# EAGLE design working (EAGLE 9.6.2)
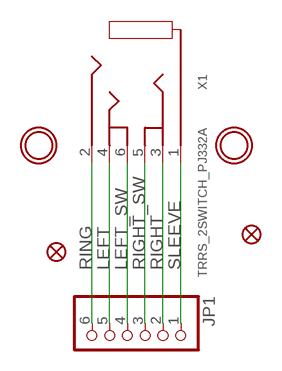
[diagram p0: schematic, sheet 1]

## Parts
FID1  FIDUCIAL_1MM  [FIDUCIAL_1MM]
FID2  FIDUCIAL_1MM  [FIDUCIAL_1MM]
JP1  HEADER-1X670MIL  [1X06_ROUND_70]
U$2  MOUNTINGHOLE2.0  [MOUNTINGHOLE_2.0_PLATED]
U$4  MOUNTINGHOLE2.0  [MOUNTINGHOLE_2.0_PLATED]
X1  TRRS_2SWITCH_PJ332A  [PJ-332A]

## Nets
LEFT: JP1.5 X1.4(TIP)
LEFT_SW: JP1.4 X1.6(TIP_SW)
RIGHT: JP1.2 X1.3(RING2)
RIGHT_SW: JP1.3 X1.5(R2_SW)
RING: JP1.6 X1.2(RING1)
SLEEVE: JP1.1 X1.1(RING)

## Library data of the parts
FID1 FID2 = microbuilder:FIDUCIAL: Fiducial Alignment Points Various fiducial points for machine vision alignment.; BOM: EXCLUDE
JP1 = microbuilder:HEADER-1X6: PIN HEADER
U$2 U$4 = adafruit_electromech:MOUNTINGHOLE: Mounting Hole For #2 screws (0.086"/2.18mm width, 0.094"/2.4mm hole) use 2.5mm; BOM: EXCLUDE
X1 = adafruit_electromech:TRRS_2SWITCH

## Board
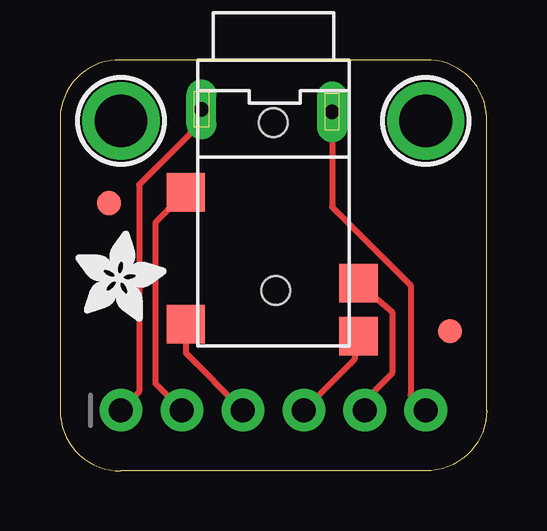
[diagram p1: board, top side]
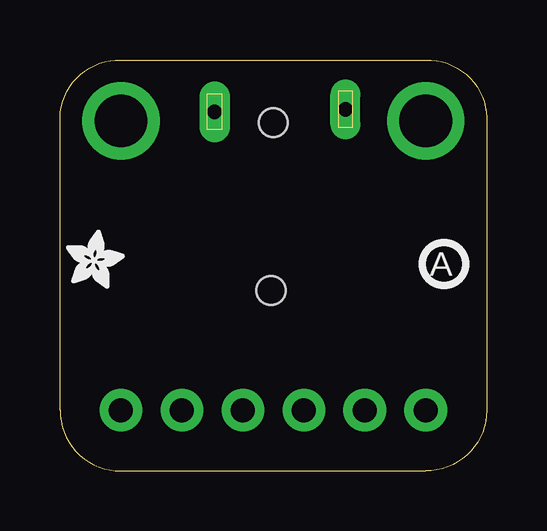
[diagram p2: board, bottom side, seen from below]

Size 17.78 x 17.14 mm. Coordinates in mm from the lower left corner, seen from the top.
Outline: 0,14.73 0,2.54 arc90 2.54,0 15.24,0 arc90 17.78,2.54 17.78,14.73 arc90 15.24,17.14 2.54,17.14 arc90 0,14.73
Copper layers (1*16): Top 0.035mm / dielectric 1.5mm / Bottom 0.035mm
Design rules "adafruit 88": minimum track width 8mil, minimum drill 15.5mil, track to track 8mil, track to pad 8mil, pad to pad 8mil, via to via 8mil, smd to smd 8mil, copper to edge 10mil, drill to drill 8mil, minimum pad ring 10mil, minimum via ring 8mil, stop-mask expansion 2mil, vias tented up to drill 20mil, thermal gap 10mil

### Footprints (pad centres in the part's own frame; a part is rotated, then mirrored left to right if it is on the bottom)
FIDUCIAL_1MM = smd 1 x 1: 1 0,0
1X06_ROUND_70 = drill 1 pad 1.778: 1 -6.35,0; 2 -3.81,0; 3 -1.27,0; 4 1.27,0; 5 3.81,0; 6 6.35,0
MOUNTINGHOLE_2.0_PLATED = drill 2.2 pad 3: P$1 0,0
PJ-332A = drill 0.6 pad 1.25 long: 1 -4.792,-3 | drill 0.6 pad 1.27 long: 2 -4.692,2.45 | smd 1.6 x 1.6: 3 -1.342,-3.65; 4 2.458,3.55; 5 4.158,-3.65; 6 4.658,3.55 | hole 1.2: -4.242,0; 2.758,0.1

### Placement (x,y rotation side)
FID1  2.03,11.18 0 top
FID2  16.26,5.84 0 top
JP1  8.89,2.54 0 top
PLABEL0  [PLABEL0]  12.7,4.19 0 top
PLABEL1  [PLABEL1]  2.29,4.19 0 top
PLABEL2  [PLABEL2]  5.08,1.02 0 top
PLABEL3  [PLABEL3]  15.11,1.02 0 top
PLABEL4  [PLABEL4]  12.7,5.97 90 top
PLABEL5  [PLABEL5]  5.08,6.1 90 top
PLABEL6  [PLABEL6]  10.41,0.89 0 top
PLABEL7  [PLABEL7]  7.62,4.19 0 top
PLABEL8  [PLABEL8]  14.99,10.67 0 top
PLABEL9  [PLABEL9]  9.53,8.64 0 bottom
U$1  [PCBFEAT-REV-040]  1.78,8.64 180 bottom
U$2  2.54,14.61 0 top
U$3  [ADAFRUIT_2.5MM]  17.53,7.62 0 bottom
U$4  15.24,14.61 0 top
U$5  [ADAFRUIT_3.5MM]  0.64,6.22 0 top
X1  8.89,10.29 270 top

### Tracks (layer width: path | path; a pad name or v marks a point on that pad's centre or on a via)
LEFT
  Top 0.254: X1.4 13.84,6.63 13.84,4.06 12.7,2.92 JP1.5
LEFT_SW
  Top 0.254: X1.6 12.26,4.64 JP1.4
RIGHT
  Top 0.254: X1.3 3.97,10.36 3.97,3.65 JP1.2
RIGHT_SW
  Top 0.254: X1.5 5.24,4.92 JP1.3
RING
  Top 0.254: X1.2 11.34,11.01 14.61,7.75 14.61,3.17 JP1.6
SLEEVE
  Top 0.254: X1.1 5.89,14.53 3.3,11.94 3.3,3.3 JP1.1